# Altium schematic sheet Transimpedance.SchDoc
size A4; SheetNumber: 4; SheetTotal: 4
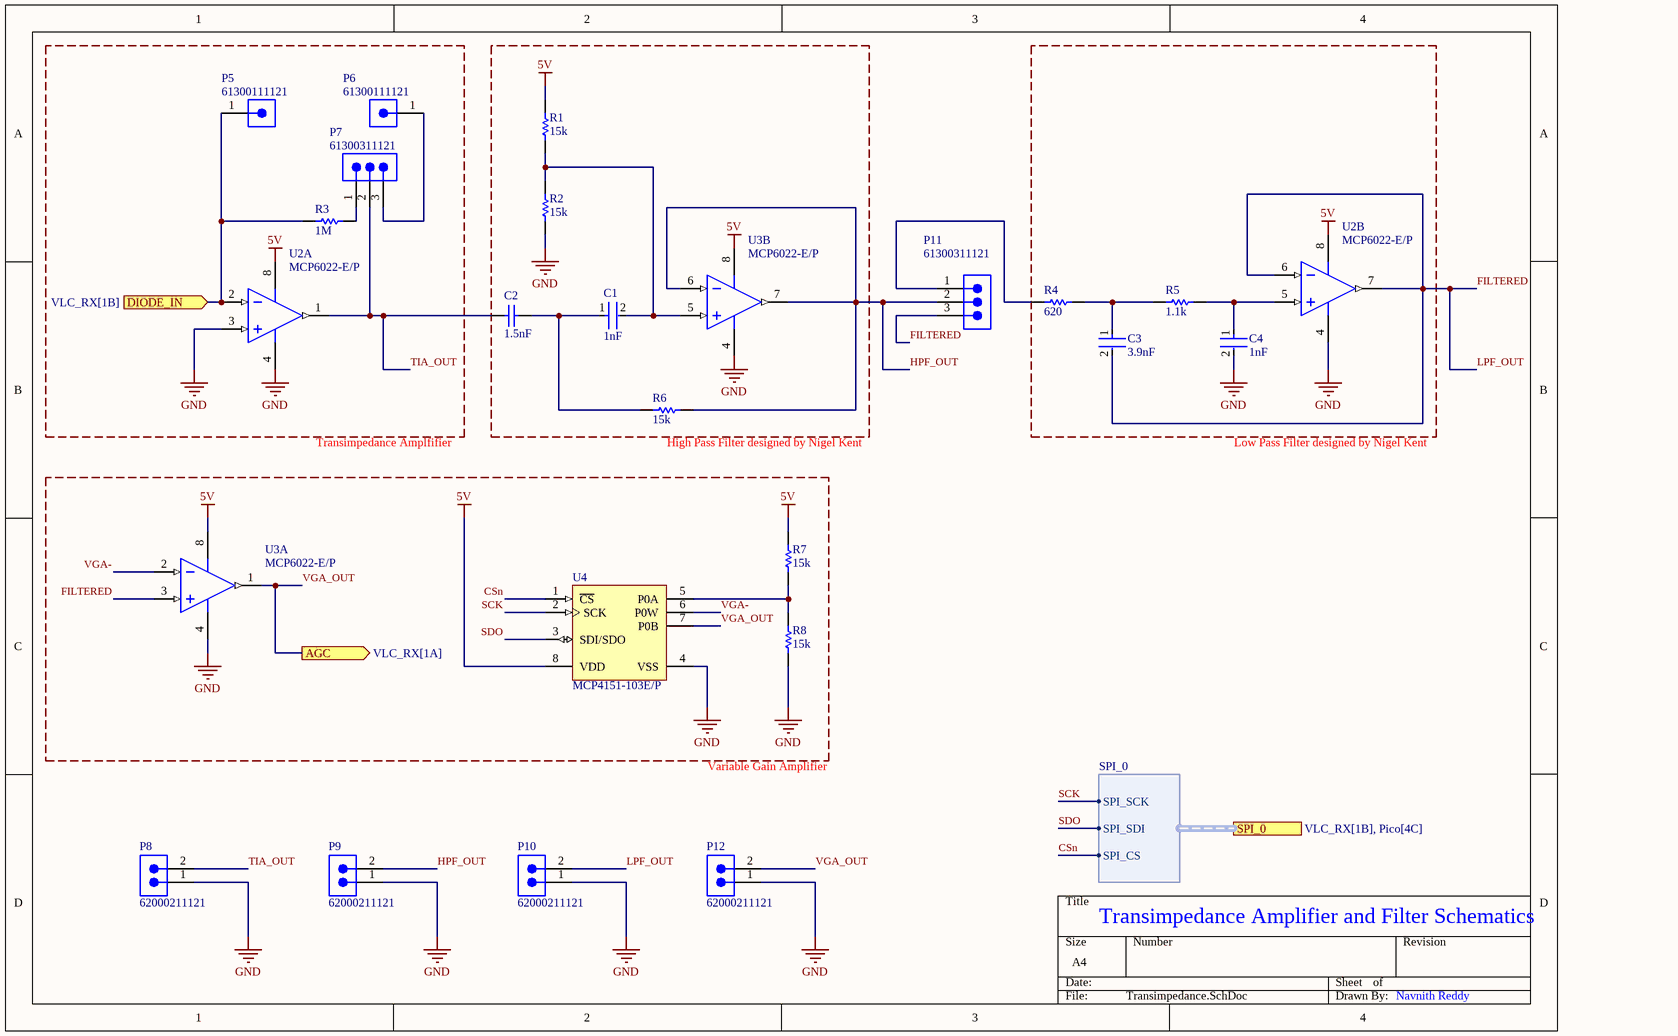
[diagram p0: Transimpedance.SchDoc]

## Parts
C1  1nF  [FP-0805-L_2_01_0_2-W_1_25-IPC_C]
C2  1.5nF  [CAPC2013X94X50ML20T25]
C3  3.9nF  [FP-C0805C-DN-MFG]
C4  1nF  [FP-0805-L_2_01_0_2-W_1_25-IPC_C]
P5  61300111121  [61300111121]
P6  61300111121  [61300111121]
P7  61300311121  [61300311121]
P8  62000211121  [62000211121]
P9  62000211121  [62000211121]
P10  62000211121  [62000211121]
P11  61300311121  [61300311121]
P12  62000211121  [62000211121]
R1  15k  [RESC2013X55X40NL15T20]
R2  15k  [RESC2013X55X40NL15T20]
R3  1M  [RESC2013X60X40LL20T25]
R4  620  [RESC2013X70X40LL20T20]
R5  1.1k  [RESC2013X50X30LL20T20]
R6  15k  [RESC2013X55X40NL15T20]
R7  15k  [RESC2013X55X40NL15T20]
R8  15k  [RESC2013X55X40NL15T20]
U2  MCP6022-E/P  [PDIP300-P8]  (parts A,B of 2)
U3  MCP6022-E/P  [PDIP300-P8]  (parts A,B of 2)
U4  MCP4151-103E/P  [PDIP300-P8]

## Ports
AGC (out, see VLC_RX[1A]), DIODE_IN (in, see VLC_RX[1B]), SPI_0 (harness SPI_0, see VLC_RX[1B], Pico[4C])

## Harnesses
SPI_0: SPI_SCK, SPI_SDI, SPI_CS

## Nets
5V: R1.2 R7.2 U2.8(VDD) U3.8(VDD) U4.8(VDD)
GND: C4.2 P8.1 P9.1 P10.1 P12.1 R2.1 R8.1 U2.3(VINA+) U2.4(VSS) U3.4(VSS) U4.4(VSS)
CSn: U4.1(~{CS}) ; port SPI_0.SPI_CS
DIODE_IN: P5.1 R3.1 U2.2(VINA-) ; port DIODE_IN
FILTERED: C3.2 P10.2 P11.3 U2.6(VINB-) U2.7(VOUTB) U3.3(VINA+)  [also labelled LPF_OUT]
HPF_OUT: P9.2 P11.2 R6.2 U3.6(VINB-) U3.7(VOUTB)
SCK: U4.2(SCK) ; port SPI_0.SPI_SCK
SDO: U4.3(SDI/SDO) ; port SPI_0.SPI_SDI
TIA_OUT: C2.1 P7.2 P8.2 U2.1(VOUTA)
VGA-: U3.2(VINA-) U4.6(P0W)
VGA_OUT: P12.2 U3.1(VOUTA) U4.7(P0B) ; port AGC
NetC1_1: C1.1 C2.2 R6.1
NetC1_2: C1.2 R1.1 R2.2 U3.5(VINB+)
NetC3_1: C3.1 R4.2 R5.1
NetC4_1: C4.1 R5.2 U2.5(VINB+)
NetP6_1: P6.1 P7.3
NetP7_1: P7.1 R3.2
NetP11_1: P11.1 R4.1
NetR7_1: R7.1 R8.2 U4.5(P0A)

## Notes on the sheet
- Transimpedance Amplfifier
- (near R6) High Pass Filter designed by Nigel Kent
- Low Pass Filter designed by Nigel Kent
- Variable Gain Amplifier
- Transimpedance Amplifier and Filter Schematics
- Navnith Reddy

## Library data of the parts
C1 C4 = CMP-1036-02979-3: General Purpose Ceramic Capacitor, 0805, 1nF, 10%, X7R, 0.15, 50V; Dissipation Factor: 2.5%; Insulation Resistance: 100GR; Radiation Hardening: No; Case Code (Imperial): 0805; Packaging: Tape and Reel; Height: 0.94mm; Number of Pins: 2; REACH SVHC: No SVHC; Case Code (Metric): 2012; Voltage: 50V; Max Operating Temperature: 125°C; Tolerance: 10%; Voltage Rating: 50V; Depth: 1.25mm; Voltage Rating (DC): 50V; Thickness: 0.037inch; Termination: SMD/SMT; Package Quantity: 1; RoHS Compliant: Yes; Mount: Surface Mount; Dielectric: X7R; Length: 2.01mm; Contact Plating: Tin; Lead Free: Lead Free; Case/Package: 0805; Width: 1.25mm; Capacitance: 1nF; Dielectric Material: Ceramic; Min Operating Temperature: -55°C
C2 = CMP-2007-04179-1: Manufacturer: AVX Interconnect / Elco; Part Number: 08051C152KAT2A
C3 = CMP-2007-03730-2: CAP CER 3900PF 200V C0G/NP0 0805; Manufacturer Part Number: C0805C392J2GACAUTO; Manufacturer: KEMET; Temperature Characteristic: C0G; Value: 3,900 pF; Description: C0805 3,900 pF C0G 30ppm/°C 5.00% 200 V; Material: Ceramic; Tolerance: 0.05; Temperature Coefficient: 30ppm/°C; Category: Cap; Lead Free: Yes; Device Class L1: Passive Components; Temperature Range Low: -55°C; Temperature Range High: +125°C; Height: 0.88mm; Voltage Rating: 200 V; Device Class L2: Capacitors; Octopart: https://octopart.com/c0805c392j2gacauto-kemet-46733246; Capacitance: 3,900 pF; Temperature: -55°C to +125°C; Ipc Land Pattern Name: CAPC200125X78; Automotive: No; Digikey Description: CAP CER 3900PF 200V C0G/NP0 0805; ComponentLink2URL: https://content.kemet.com/datasheets/KEM_C1003_C0G_SMD.pdf; Device Class L3: Ceramic Capacitors; Package: C0805C-DN; RoHS: TRUE; ComponentLink2Description: Datasheet
P5 P6 = CMP-1502-01058-2: NexarPartId: 32855518; Operating Supply Voltage: 250V; Connector Type: Male Pin; Contact Resistance: 20mΩ; Number of Contacts: 1; Gender: Male; Current Rating: 3A; Contact Mating Length: 5.9944mm; Number of Pins: 1; Lead Pitch: 2.54mm; Contact Plating: Gold; RoHS: Compliant; Termination: Solder; Mount: Through Hole; Number of Rows: 1; Orientation: Vertical; Contact Material: Copper; Packaging: Bulk; REACH SVHC: Unknown; Number of Positions: 1; Color: Black
P7 P11 = CMP-1502-01062-2: NexarPartId: 32855521; Voltage Rating: 250V; Current Rating: 3A; Connector Type: Male Pin; Number of Positions: 3; Gender: Male; Contact Resistance: 20mΩ; Pitch: 2.54mm; Max Operating Temperature: 105°C; Lead Pitch: 2.54mm; Lead Free: Lead Free; Contact Mating Length: 5.9944mm; Contact Material: Copper; Number of Pins: 3; Orientation: Vertical; Height: 8.94mm; Packaging: Bulk; Min Operating Temperature: -40°C; Mount: Through Hole; RoHS: Compliant; Number of Contacts: 3; Operating Supply Voltage: 250V; Termination: Solder; Number of Rows: 1; Contact Plating: Gold; Color: Black; REACH SVHC: Unknown
P8-P10 P12 = CMP-1502-00956-3: NexarPartId: 61924778; Number of Contacts: 2; Voltage Rating: 200V; Gender: Male; Contact Resistance: 20mΩ; Current Rating: 2A; Lead Pitch: 2mm; Max Operating Temperature: 105°C; Contact Material: Gold; Number of Rows: 1; Operating Supply Voltage: 200V; Number of Pins: 2; Orientation: Vertical; Min Operating Temperature: -40°C; Height: 6.35mm; RoHS: Non-Compliant
R1 R2 R6-R8 = CMP-2001-04735-1: Part Number: TNPW080515K0BEEA; Manufacturer: Vishay Dale
R3 = CMP-2001-00584-1: Part Number: ERA-6AEB105V; Manufacturer: Panasonic
R4 = CMP-2001-00436-1: Manufacturer: Panasonic; Part Number: ERJ-6GEYJ621V
R5 = CMP-1013-00514-2: Part Number: CRCW08051K10FKTA; Manufacturer: Vishay Dale
U2 U3 = CMP-0187-00090-3: None; Max Supply Voltage: 5.5V; Voltage Gain: 110dB; Input Bias Current: 5nA; Bandwidth: 10MHz; Number of Elements: 2; Min Supply Voltage: 2.5V; Input Offset Voltage-Max: 500uV; Power Supply Rejection Ratio (PSRR): 74dB; Nominal Supply Current: 1mA; Input Offset Voltage (Vos): 250uV; Amplifier Type: GENERAL PURPOSE; Common Mode Rejection Ratio: 70dB; Slew Rate-Nom: 7V/µs; Output Current: 22mA; Max Operating Temperature: 125°C; REACH SVHC: No SVHC; Height: 0.195inch; Length: 0.4inch; Min Operating Temperature: -40°C; Mount: Through Hole; Number of Amplifiers: 2; Harmonic Distortion: 0.00053%; Gain Bandwidth Product: 10MHz; RoHS Compliant: Yes; Unity Gain Bandwidth Product: 10MHz; Number of Channels: 2; Radiation Hardening: No; Technology: CMOS; Supply Current: 1mA; Package Quantity: 60; Lead Free: Lead Free; Width: 0.28inch; Slew Rate: 7V/µs; Case/Package: PDIP; Packaging: Rail/Tube; Number of Pins: 8; Number of Circuits: 2
U4 = CMP-0188-00257-2: 7/8-Bit Single/Dual SPI Digital POT with Volatile Memory, 8-Pin PDIP, Extended Temperature; RevisionNote: URLs added.; PackageReference: PDIP300-P8; ComponentLink1Description: Manufacturer URL; ComponentLink3URL: http://www.microchip.com/stellent/groups/techpub_sg/documents/packagingspec/en012702.pdf; PackageDescription: 8-Lead Plastic Dual In-Line (P) - 300 mil Body [PDIP]; ComponentLink2Description: Datasheet; Code_JEDEC: MS-001; ComponentLink2URL: http://ww1.microchip.com/downloads/en/DeviceDoc/22060b.pdf; DatasheetVersion: revB, Dec-2008; ComponentLink1URL: http://www.microchip.com/; ComponentLink3Description: Package Specification; PackageVersion: revBB, Aug-2009